# Altium schematic sheet inverter_2EDF7275K.SchDoc
size A2
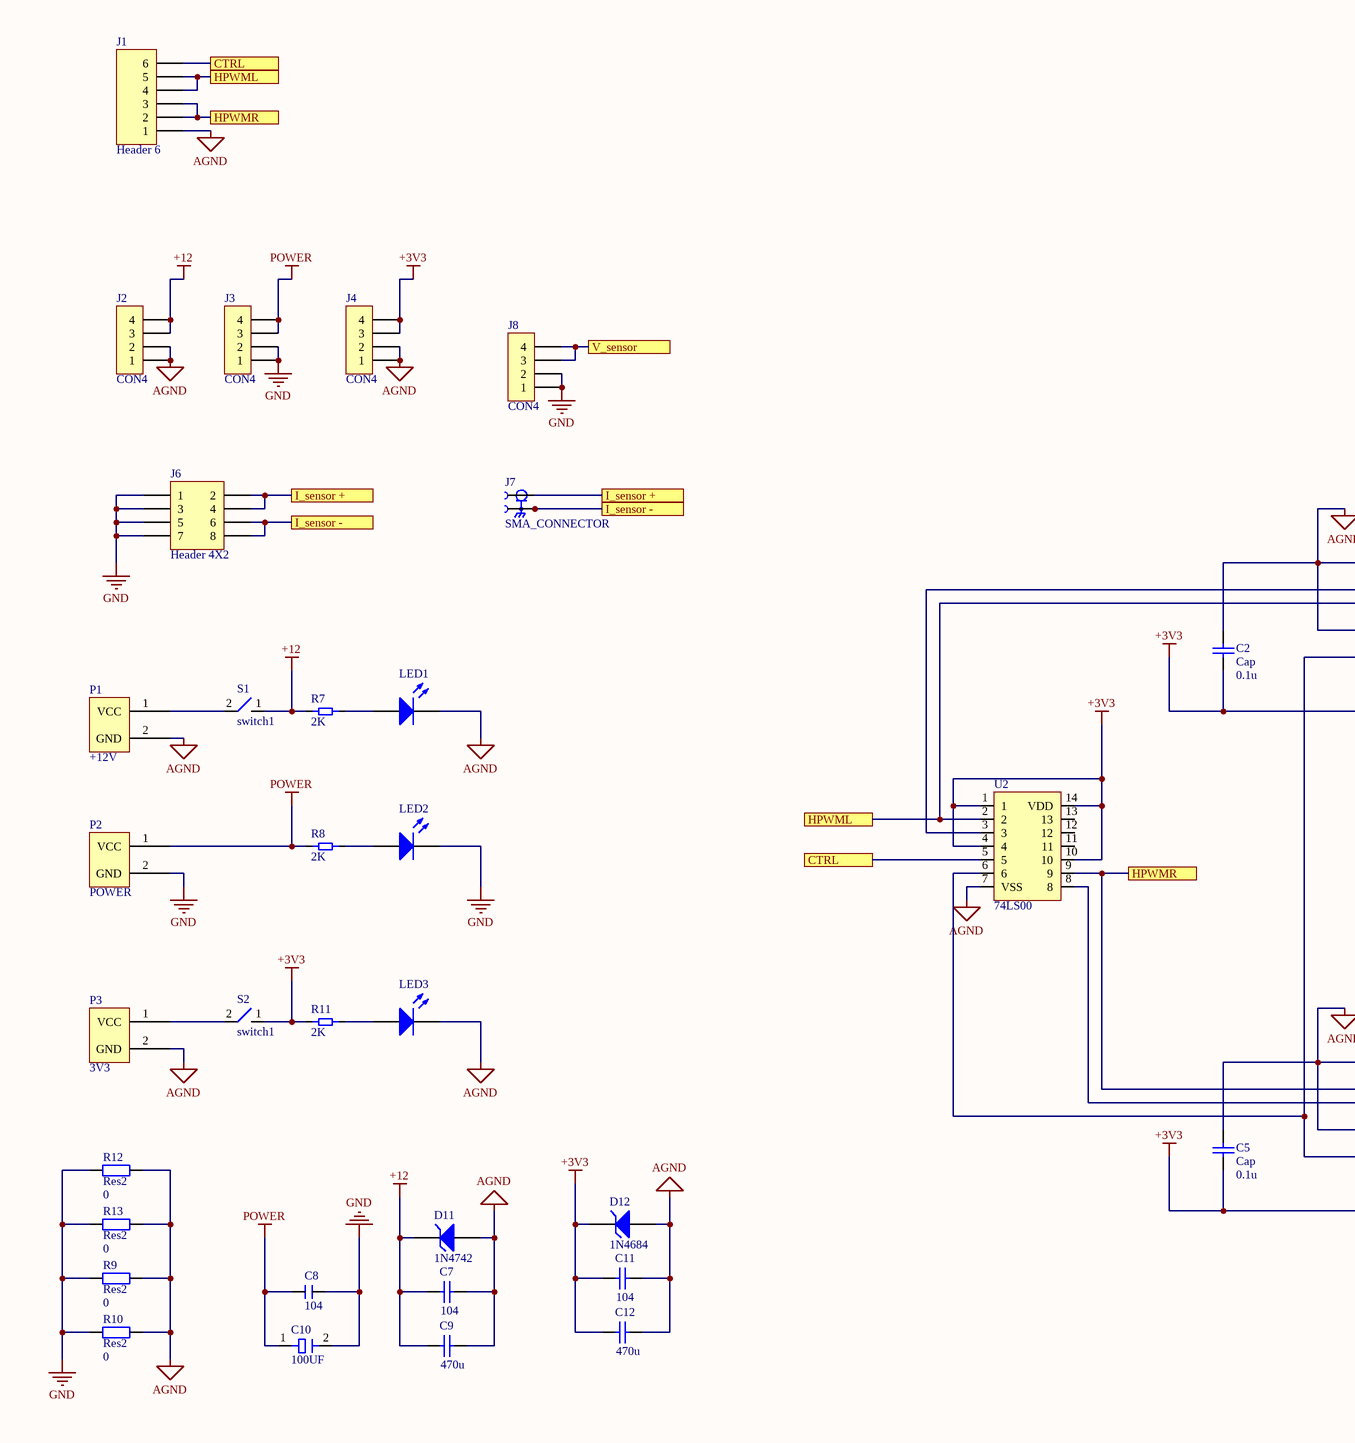
[diagram p0: inverter_2EDF7275K.SchDoc, left]
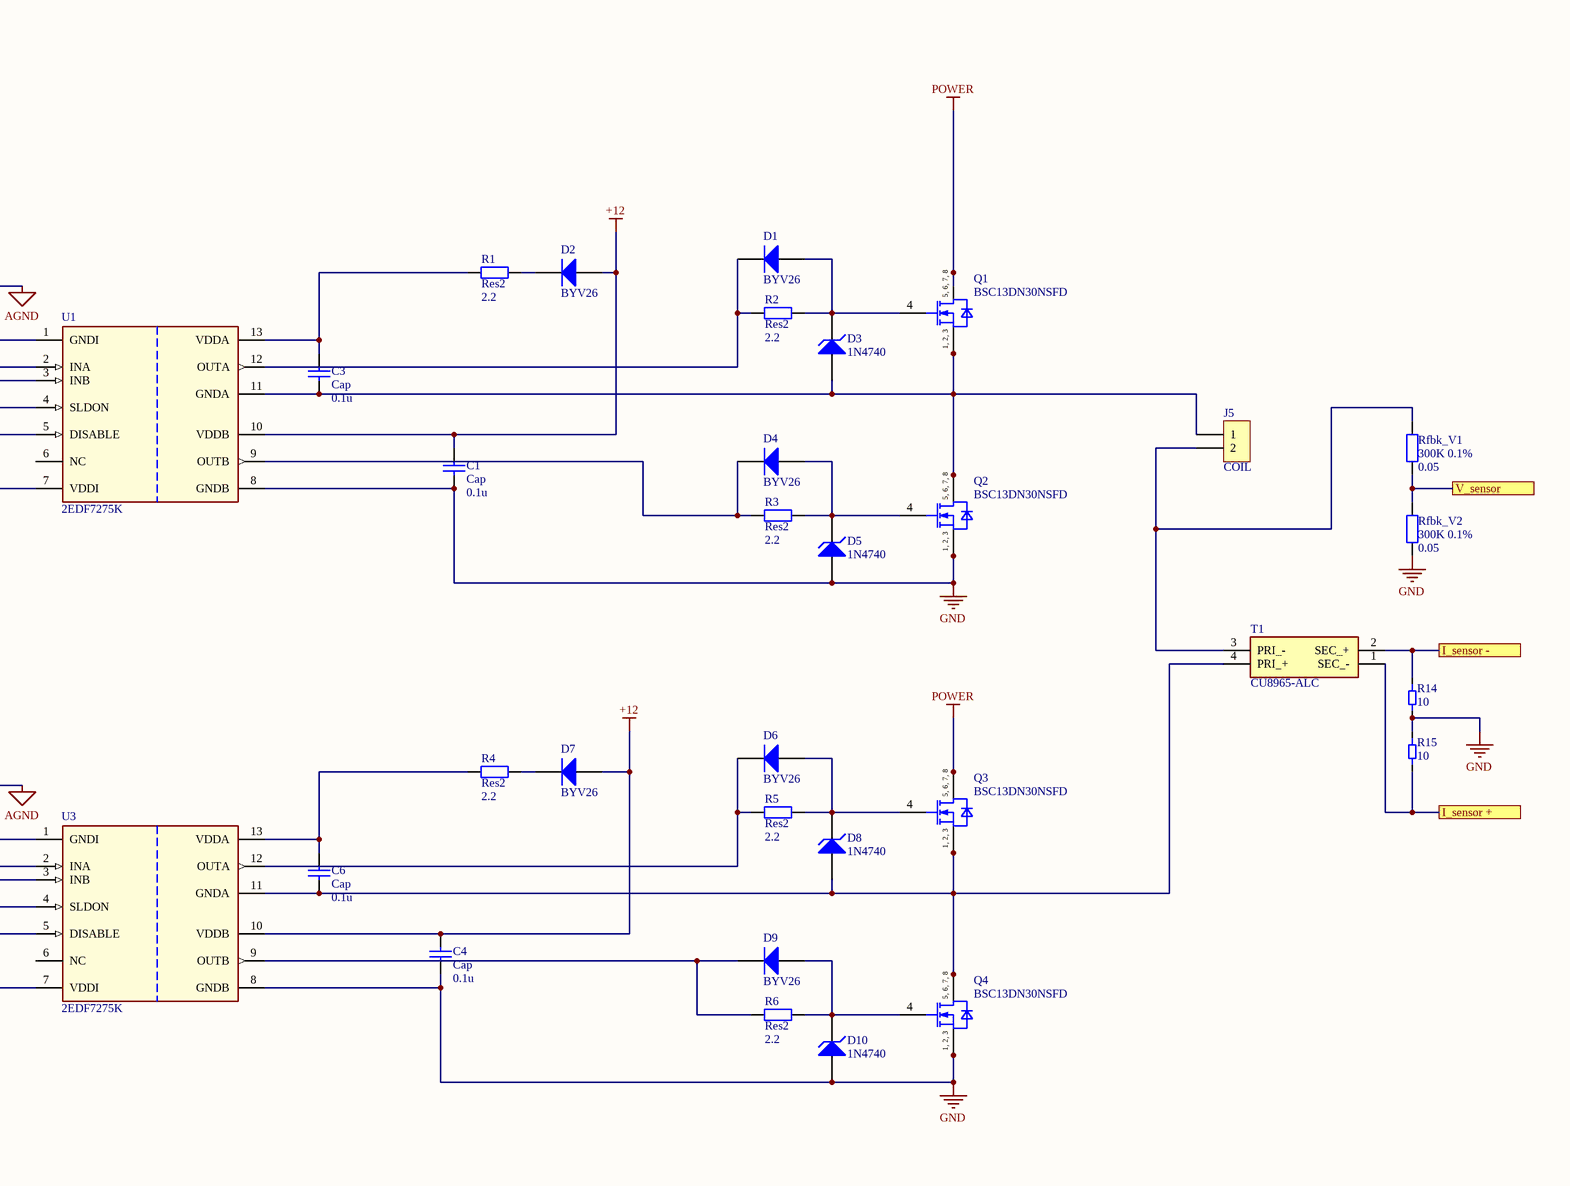
[diagram p1: inverter_2EDF7275K.SchDoc, right]

## Parts
C1  Cap  value 0.1u  [C1206]
C2  Cap  value 0.1u  [C1206]
C3  Cap  value 0.1u  [C1206]
C4  Cap  value 0.1u  [C1206]
C5  Cap  value 0.1u  [C1206]
C6  Cap  value 0.1u  [C1206]
C7  value 104  [0805C]  (hidden comment: Cap)
C8  104  [1210]
C9  value 470u  [CD6]  (hidden comment: Cap)
C10  100UF  [CE/10MM]
C11  value 104  [0805C]  (hidden comment: Cap)
C12  value 470u  [CD6]  (hidden comment: Cap)
D1  BYV26  [BYV26]
D2  BYV26  [1N4148_Stand]
D3  1N4740  [1N4148_Stand]
D4  BYV26  [BYV26]
D5  1N4740  [1N4148_Stand]
D6  BYV26  [BYV26]
D7  BYV26  [1N4148_Stand]
D8  1N4740  [1N4148_Stand]
D9  BYV26  [BYV26]
D10  1N4740  [1N4148_Stand]
D11  1N4742  [1N4148_Stand]
D12  1N4684  [1N4148_Stand]
J1  Header 6  [HDR1X6]
J2  CON4  [SIP4]
J3  CON4  [SIP4]
J4  CON4  [SIP4]
J5  COIL  [coilnew]
J6  Header 4X2  [HDR2X4]
J7  SMA_CONNECTOR  [LPRS_SMA_CONNECTOR]
J8  CON4  [SIP4]
LED1  (no value)  [0603_LED]
LED2  (no value)  [0603_LED]
LED3  (no value)  [0603_LED]
P1  +12V  [050-2]
P2  POWER  [050-2]
P3  3V3  [050-2]
Q1  BSC13DN30NSFD  [IFX-PG-TDSON-8-V]
Q2  BSC13DN30NSFD  [IFX-PG-TDSON-8-V]
Q3  BSC13DN30NSFD  [IFX-PG-TDSON-8-V]
Q4  BSC13DN30NSFD  [IFX-PG-TDSON-8-V]
R1  Res2  value 2.2  [0805R]
R2  Res2  value 2.2  [0805R]
R3  Res2  value 2.2  [0805R]
R4  Res2  value 2.2  [0805R]
R5  Res2  value 2.2  [0805R]
R6  Res2  value 2.2  [0805R]
R7  2K  [0603-R]
R8  2K  [0603-R]
R9  Res2  value 0  [1206R]
R10  Res2  value 0  [1206R]
R11  2K  [0603-R]
R12  Res2  value 0  [1206R]
R13  Res2  value 0  [1206R]
R14  10  [AXIAL0.3]
R15  10  [AXIAL0.3]
Rfbk_V1  300K 0.1%  value 0.05  [AXIAL0.3]
Rfbk_V2  300K 0.1%  value 0.05  [AXIAL0.3]
S1  switch1  [Switch_8.2*5.2]
S2  switch1  [Switch_8.2*5.2]
T1  CU8965-ALC  [CU8965ALD]
U1  2EDF7275K  [TFLGA65P500X500X106-14_13N-V]
U2  74LS00  [74ls00]
U3  2EDF7275K  [TFLGA65P500X500X106-14_13N-V]

## Ports
CTRL, HPWML, HPWMR, I_sensor +, I_sensor -, V_sensor

## Nets
+3V3: C2.1 C5.1 C11.1 C12.1 D12.2(K) J4.3 J4.4 R11.2 S2.1 U1.7(VDDI) U2.1 U2.4 U2.10 U2.14(VDD) U3.7(VDDI)
+12: C1.2 C4.2 C7.1 C9.1 D2.1(A) D7.1(A) D11.2(K) J2.3 J2.4 R7.2 S1.1 U1.10(VDDB) U3.10(VDDB)
AGND: C2.2 C5.2 C7.2 C9.2 C11.2 C12.2 D11.1(A) D12.1(A) J1.1 J2.1 J2.2 J4.1 J4.2 LED1.2(K) LED3.2(K) P1.2(GND) P3.2(GND) R9.2 R10.2 R12.2 R13.2 U1.1(GNDI) U1.4(SLDON) U2.7(VSS) U3.1(GNDI) U3.4(SLDON)
GND: C1.1 C4.1 C8.2 C10.2 D5.1(A) D10.1(A) J3.1 J3.2 J6.1 J6.3 J6.5 J6.7 J8.1 J8.2 LED2.2(K) P2.2(GND) Q2.1(SOURCE) Q2.2(SOURCE) Q2.3(SOURCE) Q4.1(SOURCE) Q4.2(SOURCE) Q4.3(SOURCE) R9.1 R10.1 R12.1 R13.1 R14.2 R15.1 Rfbk_V2.1 U1.8(GNDB) U3.8(GNDB)
POWER: C8.1 C10.1 J3.3 J3.4 P2.1(VCC) Q1.5(DRAIN) Q1.6(DRAIN) Q1.7(DRAIN) Q1.8(DRAIN) Q3.5(DRAIN) Q3.6(DRAIN) Q3.7(DRAIN) Q3.8(DRAIN) R8.2
CTRL: J1.6 U2.5 ; port CTRL
HPWML: J1.4 J1.5 U1.3(INB) U2.2 ; port HPWML
HPWMR: J1.2 J1.3 U2.9 U3.2(INA) ; port HPWMR
I_sensor +: J6.2 J6.4 J7.1 R15.2 T1.1(SEC_-) ; port I_sensor +
I_sensor -: J6.6 J6.8 J7.G1 J7.G2 J7.G3 J7.G4 R14.1 T1.2(SEC_+) ; port I_sensor -
V_sensor: J8.3 J8.4 Rfbk_V1.1 Rfbk_V2.2 ; port V_sensor
NetC3_1: C3.1 D3.1(A) J5.1 Q1.1(SOURCE) Q1.2(SOURCE) Q1.3(SOURCE) Q2.5(DRAIN) Q2.6(DRAIN) Q2.7(DRAIN) Q2.8(DRAIN) U1.11(GNDA)
NetC3_2: C3.2 R1.1 U1.13(VDDA)
NetC6_1: C6.1 D8.1(A) Q3.1(SOURCE) Q3.2(SOURCE) Q3.3(SOURCE) Q4.5(DRAIN) Q4.6(DRAIN) Q4.7(DRAIN) Q4.8(DRAIN) T1.4(PRI_+) U3.11(GNDA)
NetC6_2: C6.2 R4.1 U3.13(VDDA)
NetD1_1: D1.1(A) D3.2(K) Q1.4(GATE) R2.2
NetD1_2: D1.2(K) R2.1 U1.12(OUTA)
NetD2_2: D2.2(K) R1.2
NetD4_1: D4.1(A) D5.2(K) Q2.4(GATE) R3.2
NetD4_2: D4.2(K) R3.1 U1.9(OUTB)
NetD6_1: D6.1(A) D8.2(K) Q3.4(GATE) R5.2
NetD6_2: D6.2(K) R5.1 U3.12(OUTA)
NetD7_2: D7.2(K) R4.2
NetD9_1: D9.1(A) D10.2(K) Q4.4(GATE) R6.2
NetD9_2: D9.2(K) R6.1 U3.9(OUTB)
NetJ5_2: J5.2 Rfbk_V1.2 T1.3(PRI_-)
NetLED1_1: LED1.1(A) R7.1
NetLED2_1: LED2.1(A) R8.1
NetLED3_1: LED3.1(A) R11.1
NetP1_1: P1.1(VCC) S1.2
NetP3_1: P3.1(VCC) S2.2
NetU1_2: U1.2(INA) U2.3
NetU1_5: U1.5(DISABLE) U2.6 U3.5(DISABLE)
NetU2_8: U2.8 U3.3(INB)

Not connected (* = marked no-connect by the designer): U1 6(NC); U2 11 12 13; U3 6(NC)

## Notes on the sheet
- (in symbol BSC13DN30NSFD) 5, 6, 7, 8; 1, 2, 3

## Library data of the parts
C1-C7 C9 C11 C12 = Cap: Capacitor; Published: 8-Jun-2000; LatestRevisionDate: 17-Jul-2002; LatestRevisionNote: Re-released for DXP Platform.; PackageReference: RAD-0.3; Publisher: Altium Limited; PackageDescription: Radial Cap, Thru-Hole; 2 Leads; 0.3 in Pin Spacing
C8 = CBB
C10 = ELECTRO1: 电解电容
D1 D2 D4 D6 D7 D9 = Diode 1N4007: 1 Amp General Purpose Rectifier; Published: 8-Jun-2000; LatestRevisionDate: 17-Jul-2002; LatestRevisionNote: Re-released for DXP Platform.; DatasheetVersion: 1998; PackageVersion: Aug-1999; PackageReference: DO-41; Publisher: Altium Limited; PackageDescription: Diode, Axial; Body 5.2 x 2.7 mm (LxDia. max), Lead Dia. 0.86 mm (max); Code_JEDEC: DO-204-AL; ComponentLink1Description: Manufacturer Link; ComponentLink1URL: http://www.fairchildsemi.com/; ComponentLink2Description: Datasheet; ComponentLink2URL: http://www.fairchildsemi.com/ds/1N%2F1N4001.pdf
D3 D5 D8 D10-D12 = D Zener: Zener Diode; Published: 8-Jun-2000; LatestRevisionDate: 17-Jul-2002; LatestRevisionNote: Re-released for DXP Platform.; PackageReference: DIODE-0.7; Publisher: Altium Limited; PackageDescription: Diode, Thru-Hole; 2 Leads; 0.7 in Pin Spacing
J1 = Header 6: Header, 6-Pin; LatestRevisionDate: 17-Jul-2002; LatestRevisionNote: Re-released for DXP Platform.; Publisher: Altium Limited
J2-J4 J8 = CON4: Connector
J5 = CON2: Connector
J6 = Header 4X2: Header, 4-Pin, Dual row; LatestRevisionDate: 17-Jul-2002; LatestRevisionNote: Re-released for DXP Platform.; Publisher: Altium Limited
J7 = SMA_CONNECTOR: Straight SMA Connector; Package: None; MP: SMA_CONNECTOR; Value: *; Price: None; Availability: Unavailable
LED1-LED3 = LED2: Typical RED, GREEN, YELLOW, AMBER GaAs LED; Published: 8-Jun-2000; LatestRevisionDate: 17-Jul-2002; LatestRevisionNote: Re-released for DXP Platform.; PackageVersion: Feb-2002; PackageReference: 3.2X1.6X1.1; Publisher: Altium Limited; PackageDescription: SM LED; 2 Flat Leads
P1 P3 = POWER
Q1-Q4 = BSC13DN30NSFD: Insulated-Gate Field-Effect Transistor (IGFET), N-Channel, Enhancement, Body Diode, Pin 1 Source, 2 Source, 3 Source, 4 Gate, 5 Drain, 6 Drain, 7 Drain, 8 Drain, 8 Pins; Manufacturer: Infineon Technologies; PackageReference: PG-TDSON-8-1; Manufacturer Order Number: BSC13DN30NSFD
R1-R6 R9 R10 R12 R13 Rfbk_V1 Rfbk_V2 = Res2: Resistor; Published: 8-Jun-2000; LatestRevisionDate: 17-Jul-2002; LatestRevisionNote: Re-released for DXP Platform.; PackageReference: AXIAL-0.4; Publisher: Altium Limited; PackageDescription: Axial Device, Thru-Hole; 2 Leads; 0.4 in Pin Spacing
R7 R8 R11 R14 R15 = RES
T1 = CU8965-ALC: Transformer; Manufacturer_Name: COILCRAFT; Datasheet Link: https://www.mouser.co.uk/datasheet/2/597/cu8965-774485.pdf; Height: 3mm; Manufacturer_Part_Number: CU8965-ALC
U1 U3 = 2EDF7275K: Dual-Channel, Functional and Reinforced Isolated MOSFET Gate-Driver; Alternate View: No; Symbol Type: Dual-Channel, Functional and Reinforced Isolated MOSFET Gate-Driver; Multiple Parts: No